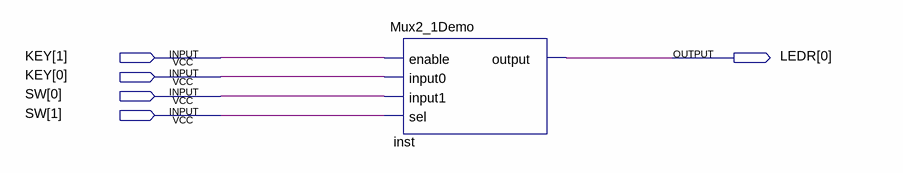
[diagram p0: schematic sheet]
// Quartus schematic Mux2_1.bdf as structural Verilog: 1 symbols, 5 pins
module Mux2_1 (
  input  [1:0] KEY,
  input  [1:0] SW,
  output [0:0] LEDR
);

  Mux2_1Demo inst (.enable(KEY[1]), .input0(KEY[0]), .input1(SW[0]), .sel(SW[1]), .\output (LEDR[0]));
endmodule
